# Altium schematic sheet PSU.Schematic.SchDoc
size A
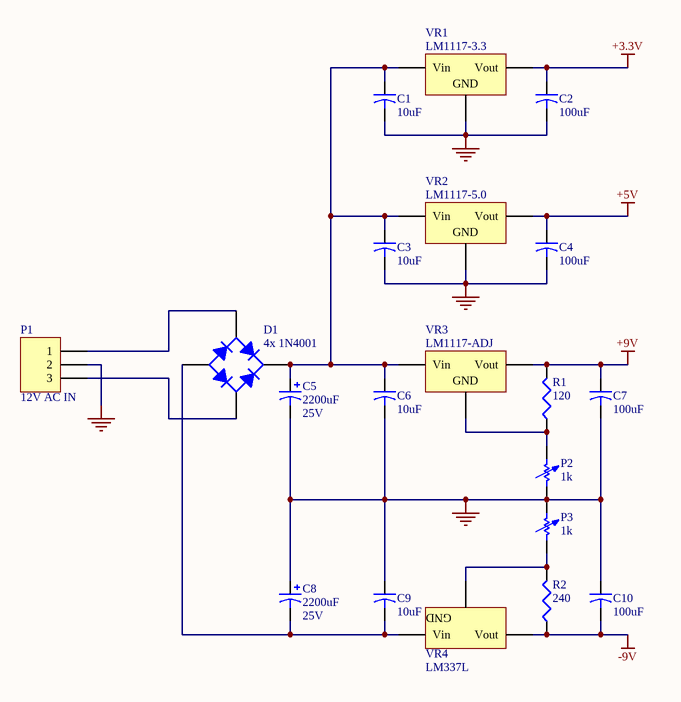
[diagram p0: PSU.Schematic.SchDoc]

## Parts
C1  10uF  [CAPC1608N]
C2  100uF  [CAPC1608N]
C3  10uF  [CAPC1608N]
C4  100uF  [CAPC1608N]
C5  2200uF  value 25V  [CAPC1608N]
C6  10uF  [CAPC1608N]
C7  100uF  [CAPC1608N]
C8  2200uF  value 25V  [CAPC1608N]
C9  10uF  [CAPC1608N]
C10  100uF  [CAPC1608N]
D1  4x 1N4001  [1N4001]
P1  12V AC IN  [HDR1X3]
P2  1k  [CAPC1608N]
P3  1k  [CAPC1608N]
R1  120  [CAPC1608N]
R2  240  [CAPC1608N]
VR1  LM1117-3.3  [LM1117]
VR2  LM1117-5.0  [LM1117]
VR3  LM1117-ADJ  [LM1117]
VR4  LM337L  [LM337L]

## Nets
+3.3V: C2.1 VR1.3(Vout)
+5V: C4.1 VR2.3(Vout)
+9V: C7.1 R1.2 VR3.3(Vout)
-9V: C10.2 R2.1 VR4.3(Vout)
GND: C1.2 C2.2 C3.2 C4.2 C5.2 C6.2 C7.2 C8.1 C9.1 C10.1 P1.2 P2.1 P3.2 VR1.2(GND) VR2.2(GND)
NetC1_1: C1.1 C3.1 C5.1 C6.1 D1.1(K) VR1.1(Vin) VR2.1(Vin) VR3.1(Vin)
NetC8_2: C8.2 C9.2 D1.3(A) VR4.1(Vin)
NetD1_2: D1.2(C) P1.3
NetD1_4: D1.4(C) P1.1
NetP2_2: P2.2 R1.1 VR3.2(ADJ)
NetP3_1: P3.1 R2.2 VR4.2(ADJ)

## Notes on the sheet
- (in symbol Volt Reg) GND

## Library data of the parts
C1 C3 C6 C9 = Cap2: Capacitor; Value: 10u; Published: 23-Sep-2002; PackageReference: CAPR5-4X5; Publisher: Altium Limited; PackageDescription: Capacitor; 2 Leads
C2 C4 C7 C10 = Cap2: Capacitor; Value: 100u; Published: 23-Sep-2002; PackageReference: CAPR5-4X5; Publisher: Altium Limited; PackageDescription: Capacitor; 2 Leads
C5 C8 = Cap Pol1: Polarized Capacitor (Radial); Published: 8-Jun-2000; LatestRevisionDate: 17-Jul-2002; LatestRevisionNote: Re-released for DXP Platform.; PackageReference: RB7.6-15; Publisher: Altium Limited; PackageDescription: Polarized Capacitor (Radial); 2 Leads
D1 = Bridge1: Full Wave Diode Bridge; Published: 8-Jun-2000; LatestRevisionDate: 29-May-2009; LatestRevisionNote: Sch pins A & K swapped.; DatasheetVersion: E2732B; PackageReference: D-38; Publisher: Altium Limited; PackageDescription: Bridge Rectifier; 4 Terminals; Body 9.4 x 9.4 mm (typ); Pitch 5.08 mm
P1 = Header 3: Header, 3-Pin; LatestRevisionDate: 17-Jul-2002; LatestRevisionNote: Re-released for DXP Platform.; Publisher: Altium Limited
P2 P3 = Res Adj1: Variable Resistor; Set Position: 0.5; Published: 8-Jun-2000; LatestRevisionDate: 17-Jul-2002; LatestRevisionNote: Re-released for DXP Platform.; PackageReference: AXIAL-0.7; Publisher: Altium Limited; PackageDescription: Axial Device, Thru-Hole; 2 Leads; 0.7 in Pin Spacing; Value: 1K
R1 R2 = Res3: Resistor; Published: 8-Jun-2000; LatestRevisionDate: 29-May-2009; LatestRevisionNote: IPC-7351 Footprint Added.; PackageReference: J1-0603; Publisher: Altium Limited; PackageDescription: Chip Resistor
  R1: Value: 120
  R2: Value: 240
VR1-VR4 = Volt Reg: Voltage Regulator; Published: 24-Mar-1999; LatestRevisionDate: 29-May-2009; LatestRevisionNote: IPC-7351 Footprint Added.; PackageReference: D2PAK; Publisher: Altium Limited; PackageDescription: 3-Pin Transistor Outline Package 2.54 mm Pitch, 15.1 mm Lead Span